# Altium schematic sheet Sheet1.SchDoc
size A; SheetNumber: 1; SheetTotal: 1
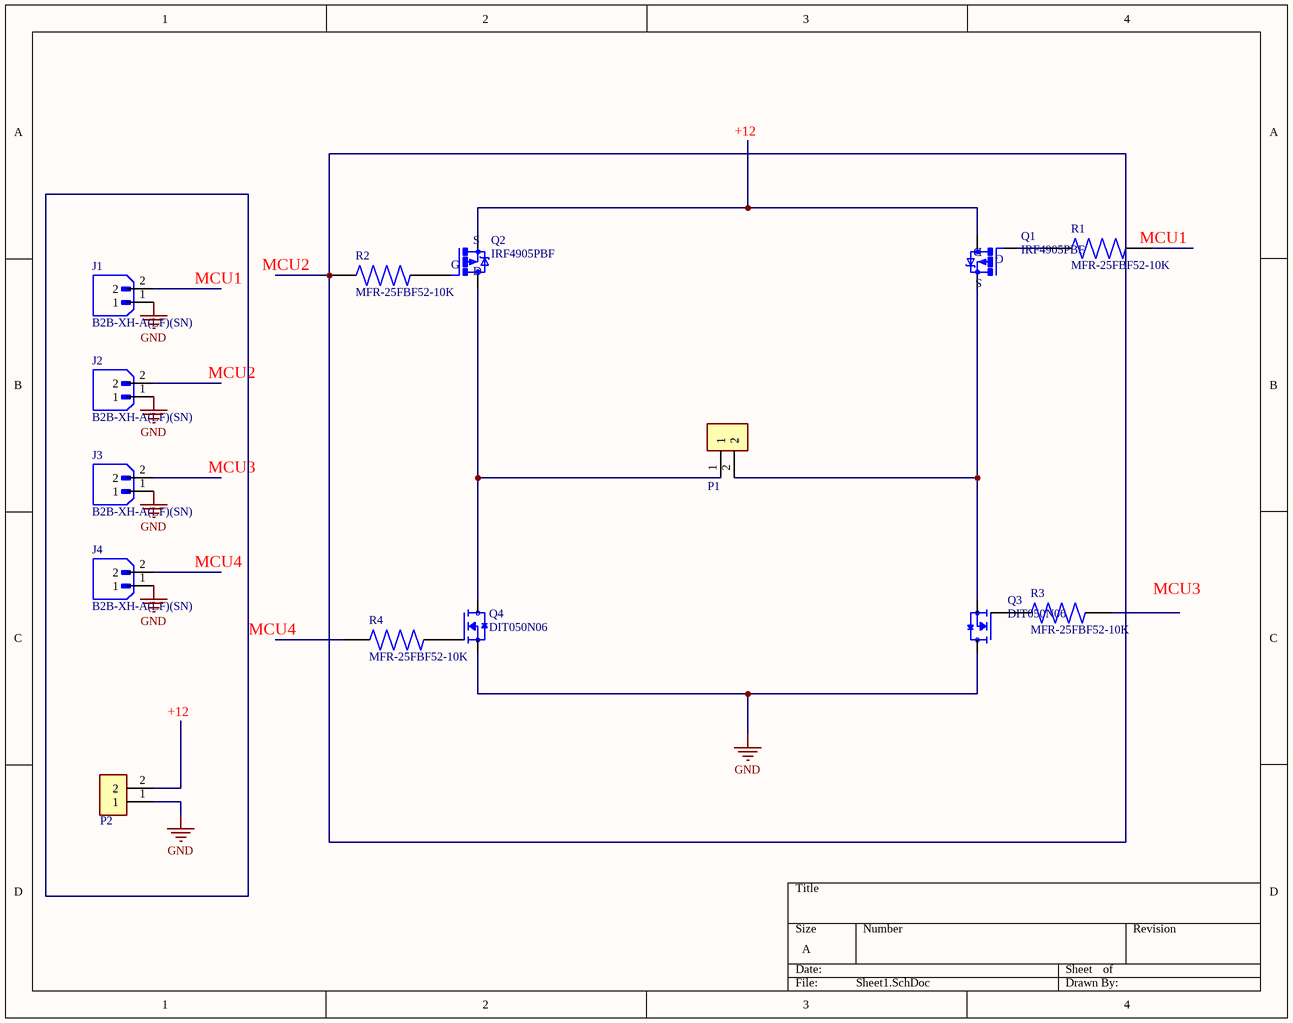
[diagram p0: Sheet1.SchDoc]

## Parts
J1  B2B-XH-A(LF)(SN)  [JST_B2B-XH-A(LF)(SN)]
J2  B2B-XH-A(LF)(SN)  [JST_B2B-XH-A(LF)(SN)]
J3  B2B-XH-A(LF)(SN)  [JST_B2B-XH-A(LF)(SN)]
J4  B2B-XH-A(LF)(SN)  [JST_B2B-XH-A(LF)(SN)]
P1  282837-2  [TE_282837-2]  (value not drawn)
P2  282837-2  [TE_282837-2]  (value not drawn)
Q1  IRF4905PBF  [TO220BH]
Q2  IRF4905PBF  [TO220BH]
Q3  DIT050N06  [TO254P1010X450X1980-3B]
Q4  DIT050N06  [TO254P1010X450X1980-3B]
R1  MFR-25FBF52-10K  [RESAD1100W55L680D260]
R2  MFR-25FBF52-10K  [RESAD1100W55L680D260]
R3  MFR-25FBF52-10K  [RESAD1100W55L680D260]
R4  MFR-25FBF52-10K  [RESAD1100W55L680D260]

## Nets
GND: J1.1 J2.1 J3.1 J4.1 P2.1 Q3.2(D) Q4.3(S)
NetP1_1: P1.1 Q2.D Q4.2(D)
NetP1_2: P1.2 Q1.S Q3.3(S)
NetQ1_D: Q1.D Q2.S
NetQ1_G: Q1.G R1.1
NetQ2_G: Q2.G R2.2
NetQ3_1: Q3.1(G) R3.1
NetQ4_1: Q4.1(G) R4.2

Not connected (* = marked no-connect by the designer): J1 2; J2 2; J3 2; J4 2; P2 2; R1 2; R2 1; R3 2; R4 1

## Notes on the sheet
- +12
- MCU1
- MCU2
- (near R1) MCU1
- MCU3
- MCU4

## Library data of the parts
J1-J4 = B2B-XH-A(LF)(SN): Connector Header Through Hole 2 position 0.098 (2.50mm); MF: JST Sales America Inc.; SnapEDA_Link: https://www.snapeda.com/parts/B2B-XH-A(LF)(SN)/JST+Sales+America+Inc./view-part/?ref=snap; Package: None; Value: *; MP: B2B-XH-A(LF)(SN); Check_prices: https://www.snapeda.com/parts/B2B-XH-A(LF)(SN)/JST+Sales+America+Inc./view-part/?ref=eda
P1 P2 = 282837-2: MF: TE Connectivity; SnapEDA_Link: https://www.snapeda.com/parts/282837-2/TE+Connectivity+AMP+Connectors/view-part/?ref=snap; Price: None; Check_prices: https://www.snapeda.com/parts/282837-2/TE+Connectivity+AMP+Connectors/view-part/?ref=eda; Purchase-URL: https://pricing.snapeda.com/search/part/282837-2/?ref=eda; MP: 282837-2; Value: *; Availability: In Stock; Package: None
Q1 Q2 = IRF4905PBF: P-Channel 55 V 74A (Tc) 200W (Tc) Through Hole TO-220AB; MF: Infineon; Check_prices: https://www.snapeda.com/parts/IRF4905PBF/Infineon+Technologies/view-part/?ref=eda; Value: *; Availability: In Stock; MP: IRF4905PBF; Price: None; Package: TO-220 Infineon; SnapEDA_Link: https://www.snapeda.com/parts/IRF4905PBF/Infineon+Technologies/view-part/?ref=snap; Purchase-URL: https://pricing.snapeda.com/search/part/IRF4905PBF/?ref=eda
R1-R4 = MFR-25FBF52-10K: 10.2 kOhms Â±1% 0.25W, 1/4W Through Hole Resistor Axial - Metal Film; MF: Yageo; SnapEDA_Link: https://www.snapeda.com/parts/MFR-25FBF52-10K/Yageo/view-part/?ref=snap; Availability: In Stock; Price: None; Value: *; Check_prices: https://www.snapeda.com/parts/MFR-25FBF52-10K/Yageo/view-part/?ref=eda; Purchase-URL: https://pricing.snapeda.com/search/part/MFR-25FBF52-10K/?ref=eda; MP: MFR-25FBF52-10K; Package: Axial Yageo
Q3 Q4 = DIT050N06: Package: None; Price: None; Value: *; MP: DIT050N06; Availability: Unavailable